# Altium schematic sheet BMS.SchDoc: BMS
size Letter; DrawnBy: Ayesha Ebrahim
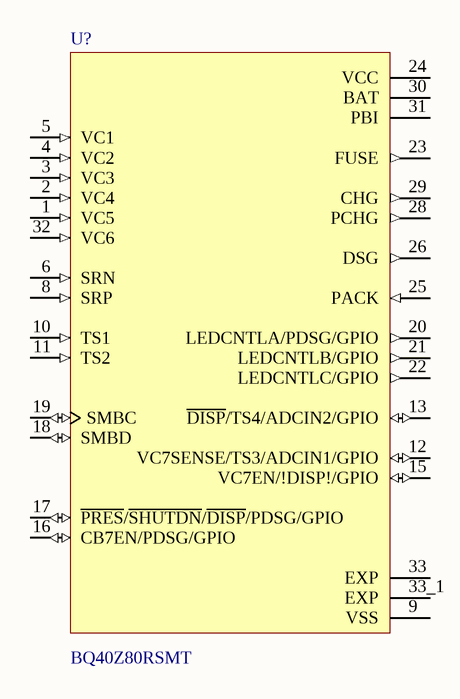
[diagram p0: BMS.SchDoc]

## Parts
U?  BQ40Z80RSMT  [BQ40Z80RSMT]

## Nets

Not connected (* = marked no-connect by the designer): U? 1(VC5) 2(VC4) 3(VC3) 4(VC2) 5(VC1) 6(SRN) 8(SRP) 9(VSS) 10(TS1) 11(TS2) 12(VC7SENSE/TS3/ADCIN1/GPIO) 13(~{DISP}/TS4/ADCIN2/GPIO) 15(VC7EN/!DISP!/GPIO) 16(CB7EN/PDSG/GPIO) 17(~{PRES}/~{SHUTDN}/~{DISP}/PDSG/GPIO) 18(SMBD) 19(SMBC) 20(LEDCNTLA/PDSG/GPIO) 21(LEDCNTLB/GPIO) 22(LEDCNTLC/GPIO) 23(FUSE) 24(VCC) 25(PACK) 26(DSG) 28(PCHG) 29(CHG) 30(BAT) 31(PBI) 32(VC6) 33(EXP) 33_1(EXP)

## Notes on the sheet
- Title
- Size:
- Date:
- Letter
- Drawn By:
- Sheet
- of
- File:

## Library data of the parts
U? = BATT_MANAGER: POWER MANAGEMENT IC: Battery Multi-Function Controller IC Lithium Ion/Polymer 32-VQFN (4x4); Manufacturer 1: Texas Instruments; SnapEDA_Link: https://www.snapeda.com/parts/BQ40Z80RSMT/Texas%20Instruments/view-part/2782044/?ref=snap; Value: *; Manufacturer Part Number 1: BQ40Z80RSMT; Supplier Part Number 1: 296-BQ40Z80RSMTCT-ND; Supplier 1: Digi-Key